# Altium schematic sheet USB_PD_POWER.SchDoc
size Letter; SheetNumber: 14; SheetTotal: 15
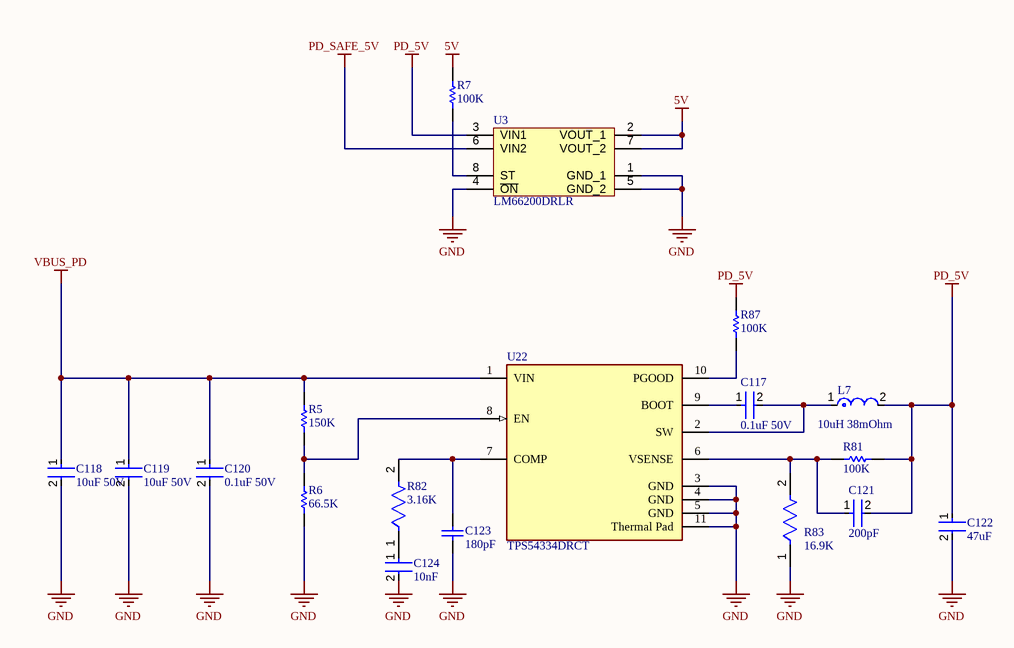
[diagram p0: USB_PD_POWER.SchDoc]

## Parts
C117  0.1uF 50V  [FP-C0805C-DN-MFG]
C118  10uF 50V  [FP-C3225-250-0_4-MFG]
C119  10uF 50V  [FP-C3225-250-0_4-MFG]
C120  0.1uF 50V  [FP-C0805C-DN-MFG]
C121  200pF  [FP-C0402-BB-MFG]
C122  47uF  [FP-C3216-160-0_2-IPC_C]
C123  180pF  [CAPC1005X55X25NL05T10]
C124  10nF  [FP-GRM155-0_05-IPC_C]
L7  10uH 38mOhm  [FP-XAL5050-MFG]
R5  150K  [RESC1005X40X25NL10T10]
R6  66.5K  [RESC1005X40X25ML05T05]
R7  100K  [RESC1005X40X25NL05T10]
R81  100K  [RESC1005X40X25NL05T10]
R82  3.16K  [FP-CRCW0402-e3-IPC_C]
R83  16.9K  [FP-CRCW0402-e3-MFG]
R87  100K  [RESC1005X40X25NL05T10]
U3  LM66200DRLR  [SOTFL50P160X60-8N]
U22  TPS54334DRCT  [FP-DRC0010J-IPC_B]

## Nets
5V: R7.1 U3.2(VOUT_1) U3.7(VOUT_2)
GND: C118.2 C119.2 C120.2 C122.2 C123.1 C124.2 R6.1 R83.1 U3.1(GND_1) U3.4(~{ON}) U3.5(GND_2) U22.3(GND) U22.4(GND) U22.5(GND) U22.11(Thermal_Pad)
PD_5V: C121.2 C122.1 L7.2 R81.1 R87.1 U3.3(VIN1)
PD_SAFE_5V: U3.6(VIN2)
VBUS_PD: C118.1 C119.1 C120.1 R5.2 U22.1(VIN)
NetC117_1: C117.1 U22.9(BOOT)
NetC117_2: C117.2 L7.1 U22.2(SW)
NetC121_1: C121.1 R81.2 R83.2 U22.6(VSENSE)
NetC123_2: C123.2 R82.2 U22.7(COMP)
NetC124_1: C124.1 R82.1
NetR5_1: R5.1 R6.2 U22.8(EN)
NetR7_2: R7.2 U3.8(ST)
NetR87_2: R87.2 U22.10(PGOOD)

## Notes on the sheet
- Title
- Copyright (c) Meta Platforms, Inc. and affiliates.
  All rights reserved.
  This source code is licensed under the license found in the
  LICENSE file in the root directory of this source tree.
- Sheet
- of

## Library data of the parts
C117 C120 = CMP-1036-04423-3: CAP CER 0.1UF 50V X7R 0805; Manufacturer Part Number: C0805C104M5RACTU; Manufacturer: KEMET; Tolerance: 0.2; Temperature Coefficient: 30ppm/°C; Material: Ceramic; Capacitance: 0.10 μF; Value: 0.10 μF; Temperature: -55°C to +125°C; RoHS: TRUE; Temperature Range Low: -55°C; Device Class L3: Ceramic Capacitors; Octopart: https://octopart.com/c0805c104m5ractu-kemet-129379; Ipc Land Pattern Name: CAPC200125X78; Mouser Description: Multilayer Ceramic Capacitors MLCC - SMD/SMT 50volts 0.1uF X7R 20%; Temperature Range High: +125°C; Package: C0805C-DN; Temperature Characteristic: X7R; Automotive: No; ComponentLink2URL: https://content.kemet.com/datasheets/KEM_C1003_C0G_SMD.pdf; Device Class L1: Passive Components; ComponentLink2Description: Datasheet; Device Class L2: Capacitors; Voltage Rating: 50 V; Digikey Description: CAP CER 0.1UF 50V X7R 0805; Lead Free: Yes; Height: 0.88mm; Category: Cap
C118 C119 = CMP-08246-002653-1: Multilayer Ceramic Capacitors 10uF ±20% 50V X7R SMD 1210; Width: 0.098inch; Package Quantity: 1000; Height: 2.5mm; Dielectric Material: Ceramic; Voltage Rating: 50V; Series: C; Capacitance: 10uF; Tolerance: 20%; Weight: 0.000564oz; Case/Package: 1210; Case Code (Imperial): 1210; Dielectric: X7R; Case Code (Metric): 3225; REACH SVHC: No SVHC; Packaging: Tape and Reel; Length: 0.126inch; Termination: SMD/SMT; Min Operating Temperature: -55°C; Voltage Rating (DC): 50V; Lead Free: Lead Free; Max Operating Temperature: 125°C; Thickness: 0.11inch; Mount: Surface Mount
C121 = CMP-1034-01347-3: CAP CER 200PF 50V NP0 0402; Manufacturer Part Number: C0402C201J5GACTU; Manufacturer: Kemet; Temperature Coefficient: 15%; Temperature Characteristic: C0G; Material: Ceramic; Tolerance: 0.05; Lead Free: Yes; Temperature: -55°C to +125°C; Height: 0.55mm; ComponentLink2URL: https://content.kemet.com/datasheets/KEM_C1002_X7R_SMD.pdf; Temperature Range High: +125°C; RoHS: TRUE; Ipc Land Pattern Name: CAPC10050X50; Package: C0402-BB; Digikey Description: CAP CER 200PF 50V NP0 0402; Octopart: https://octopart.com/c0402c201j5gactu-kemet-19049754; Category: Cap; Value: 200 pF; Automotive: No; Capacitance: 200 pF; ComponentLink2Description: Datasheet; Device Class L3: Ceramic Capacitors; Temperature Range Low: -55°C; Device Class L1: Passive Components; Voltage Rating: 50 V; Mouser Description: Cap Ceramic 200pF 50V C0G 5% SMD 0402 125°C Punched Paper T/R; Device Class L2: Capacitors
C122 = CMP-08246-007132-1: Multilayer Ceramic Capacitors 47uF ±20% 10V X6S SMD 1206; Case Code (Metric): 3216; Min Operating Temperature: -55°C; Case Code (Imperial): 1206; Lead Free: Lead Free; Package Quantity: 1; Dielectric Material: Ceramic; Case/Package: 1206; REACH SVHC: No SVHC; Resistor Type: Ceramic; Capacitance: 47uF; Depth: 1.6mm; Mount: Surface Mount; Voltage Rating (DC): 10V; RoHS Compliant: Yes; Width: 1.6mm; Length: 3.2mm; Termination: SMD/SMT; Max Operating Temperature: 105°C; Construction: Flat; Voltage Rating: 10V; Series: C; Dielectric: X6S; Tolerance: 20%; Thickness: 0.071inch; Packaging: Tape and Reel; Height: 1.6mm; Weight: 0.000571oz
C123 = CMP-2008-04274-1: Manufacturer: Murata; Part Number: GRM1555C1H181JA01D
C124 = CMP-2008-04637-5: Chip Multilayer Ceramic Capacitors for General Purpose, 0402, 10000pF, X7R, 15%, 10%, 50V; Voltage: 25V; Tolerance: 10%; Mount: Surface Mount; Lead Free: Lead Free; Radiation Hardening: No; Case Code (Imperial): 0402; REACH SVHC: No SVHC; Case/Package: 0402; Dielectric: X7R; Voltage Rating (DC): 50V; Max Operating Temperature: 125°C; Termination: SMD/SMT; Material: Ceramic; Width: 0.02inch; Package Quantity: 1; Voltage Rating: 50V; Thickness: 0.022inch; Packaging: Tape and Reel; Height: 0.5mm; Number of Pins: 2; Case Code (Metric): 1005; Min Operating Temperature: -55°C; Length: 1mm; Capacitance: 10nF; Depth: 0.5mm
L7 = CMP-11268-000214-1: Power Inductors - SMD 8.2uH Shld 20% 6.1A 34.95mOhms AECQ2; Shielding: Shielded; Core Material: Composite; DC Resistance (DCR): 34.95mR; Saturation Current: 5.6A; Self Resonant Frequency: 18MHz; Test Frequency: 100kHz; Series: XAL5050; Width: 5.48mm; RoHS Compliant: Yes; Height: 5.1mm; Min Operating Temperature: -40°C; Length: 5.68mm; Packaging: Tape and Reel; Inductance: 8.2uH; Mount: Surface Mount; Max DC Current: 6.1A; Inductance Tolerance: 20%; Case/Package: SMD/SMT; Reach SVHC Compliant: Yes; Lead Free: Contains Lead; RMS Current (Irms): 6.1A; Termination: SMD/SMT; Tolerance: 20%; Package Quantity: 250; Max Operating Temperature: 125°C
R5 = CMP-2002-05692-1: Part Number: CRG0402F150K; Manufacturer: TE Connectivity / AMP
R6 = CMP-2002-00162-1: Part Number: CRCW040266K5FKED; Manufacturer: Vishay Dale
R7 R81 R87 = CMP-2002-07343-1: Part Number: RC0402FR-07100KL; Manufacturer: Yageo / Phycomp
R82 = CMP-02407-010089-1: RES Thick Film, 3.16kΩ, 1%, 0.063W, 100ppm/°C, 0402
R83 = CMP-2002-08240-2: RES Thick Film, 16.9kΩ, 1%, 0.063W, 100ppm/°C, 0402; Resistance: 16.9kR; Voltage Rating: 50V; Max Power Dissipation: 63mW; Tolerance: 1%; Weight: 2.3E-05oz; Case/Package: 0402; Package Quantity: 10; Packaging: Tape and Reel; Case Code (Imperial): 0402; Number of Pins: 2; Height: 0.016inch; Width: 0.02inch; Number of Terminations: 2; Depth: 0.5mm; Composition: Thick Film; Features: Automotive AEC-Q200; Termination: SMD/SMT; Radiation Hardening: No; Temperature Coefficient: 100ppm/°C; Military Standard: Not; Length: 1mm; Min Operating Temperature: -55°C; Contact Plating: Tin; Max Operating Temperature: 155°C; Power Rating: 63mW; Case Code (Metric): 1005
U3 = LM66200DRLR: Integrated Circuit; Manufacturer_Name: Texas Instruments; Datasheet Link: https://www.ti.com/lit/gpn/lm66200; Height: 0.6mm; Manufacturer_Part_Number: LM66200DRLR; Mouser Part Number: 595-LM66200DRLR; Mouser Price/Stock: https://www.mouser.co.uk/ProductDetail/Texas-Instruments/LM66200DRLR?qs=Rp5uXu7WBW90hnpZAkIOdQ%3D%3D; Arrow Part Number: LM66200DRLR; Arrow Price/Stock: https://www.arrow.com/en/products/lm66200drlr/texas-instruments?region=nac
U22 = CMP-04918-000651-1: IC REG BUCK ADJUSTABLE 3A 10VSON; Number of Outputs: 1; Output Configuration: Positive; Min Input Voltage: 4.2V; Quiescent Current: 600uA; Switching Frequency: 570kHz; Output Voltage: 24V; Min Output Voltage: 800mV; Synchronous Rectifier: Yes; Max Input Voltage: 28V; Output Current: 3A; REACH SVHC: No SVHC; Output Type: Adjustable; Packaging: Tape and Reel; RoHS Compliant: Yes; Max Output Voltage: 24V; Min Operating Temperature: -40°C; Lead Free: Lead Free; Mount: Surface Mount; Max Operating Temperature: 85°C; Number of Pins: 10